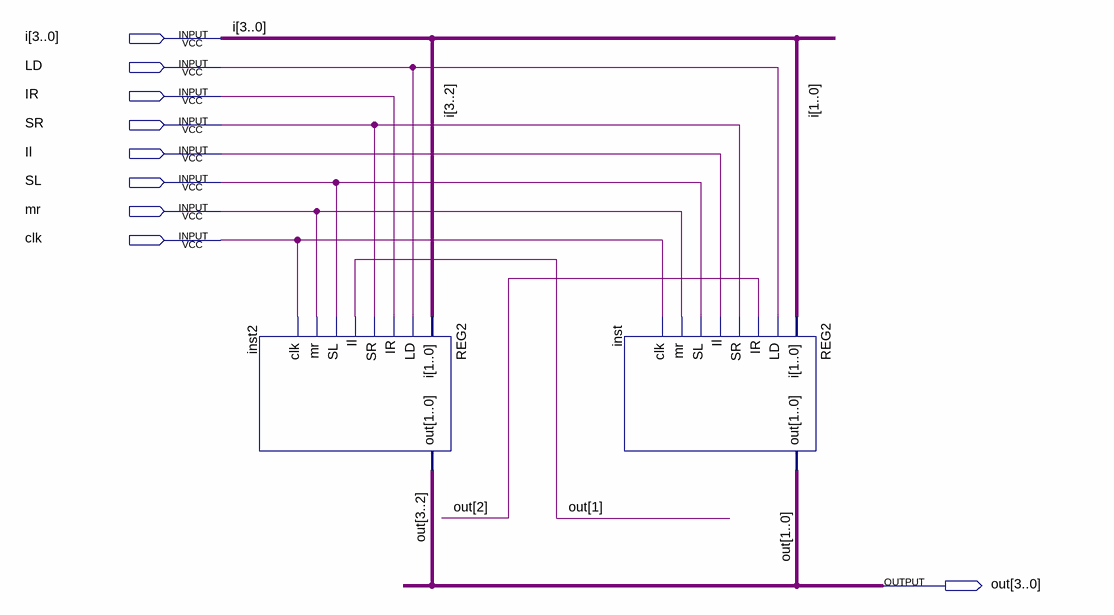
[diagram p0: schematic sheet]
// Quartus schematic REG4.bdf as structural Verilog: 2 symbols, 9 pins
module REG4 (
  input  [3:0] i,
  input  LD,
  input  IR,
  input  SR,
  input  Il,
  input  SL,
  input  mr,
  input  clk,
  output [3:0] out
);

  REG2 inst2 (.i(i[3:2]), .LD(LD), .IR(IR), .SR(SR), .Il(out[1]), .SL(SL), .mr(mr), .clk(clk), .out(out[3:2]));
  REG2 inst (.i(i[1:0]), .LD(LD), .IR(out[2]), .SR(SR), .Il(Il), .SL(SL), .mr(mr), .clk(clk), .out(out[1:0]));
endmodule
